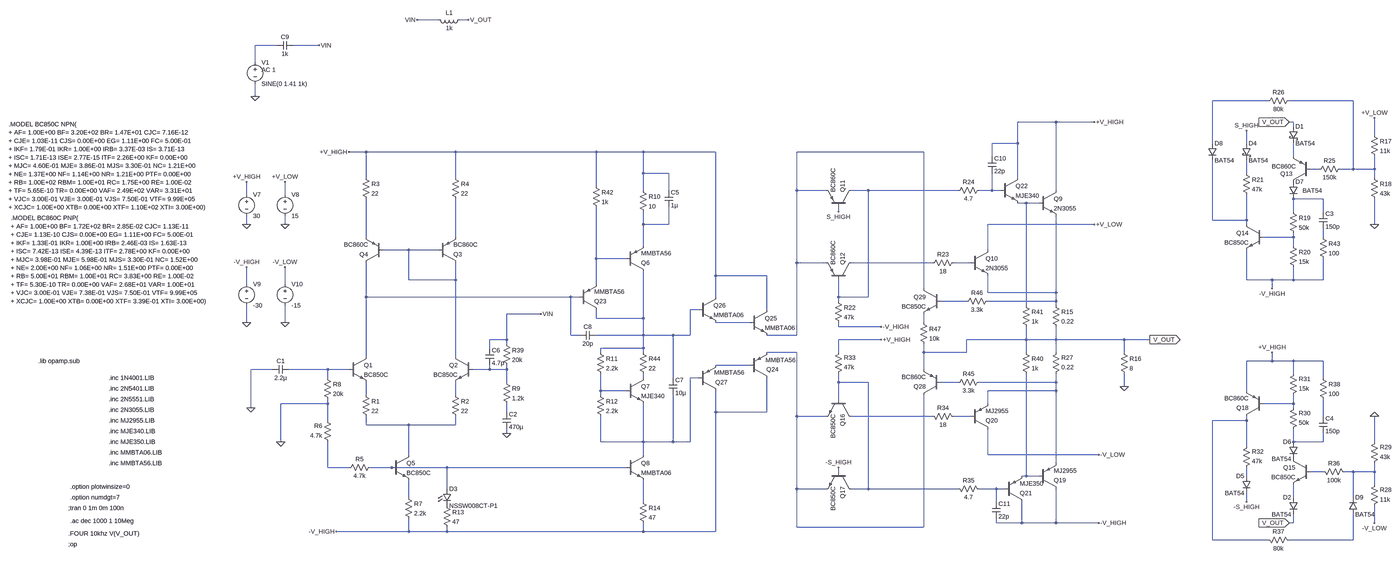
[diagram p0: schematic TPdisenio compensacion.asc, whole sheet]
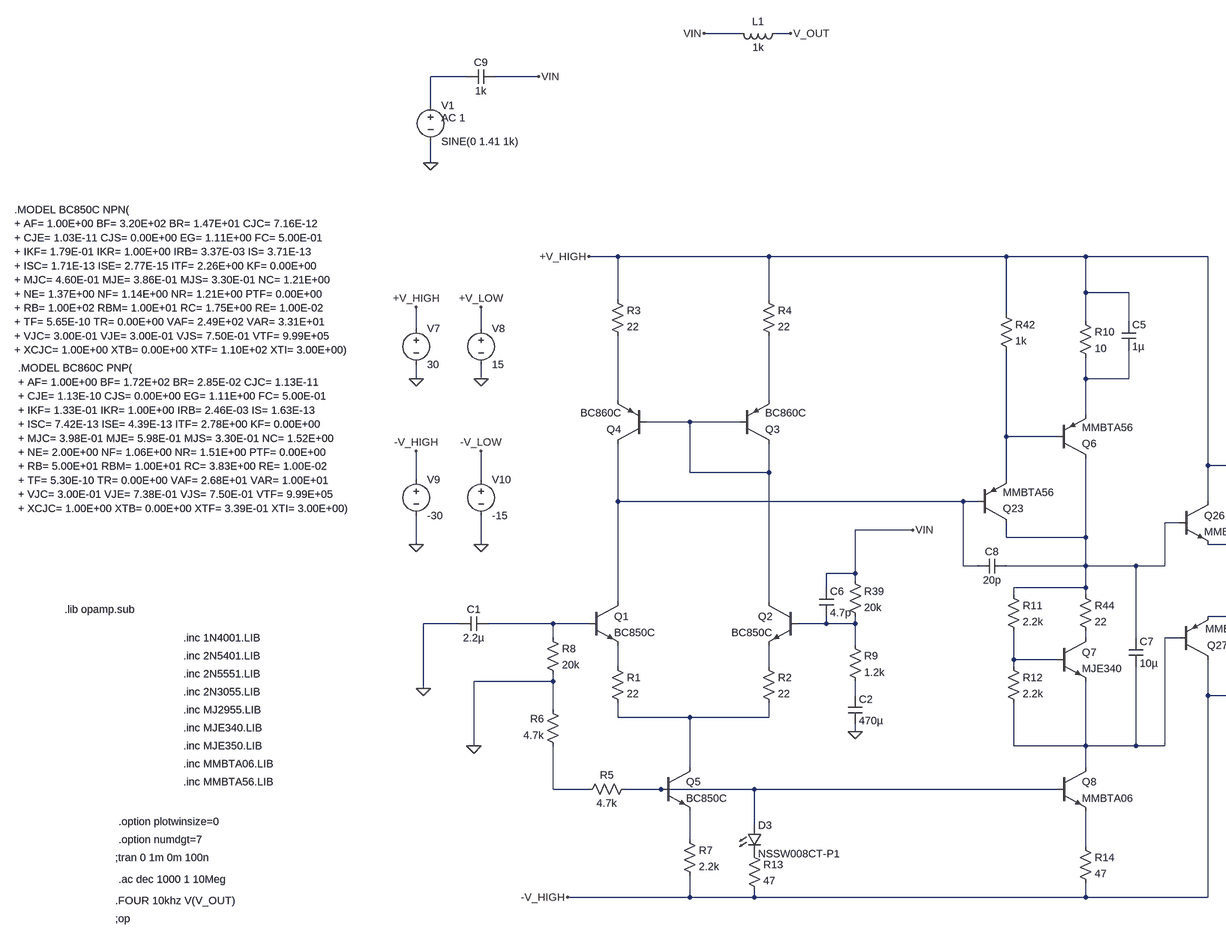
[diagram p1: schematic TPdisenio compensacion.asc, part, row 1 of 1, column 1 of 2]
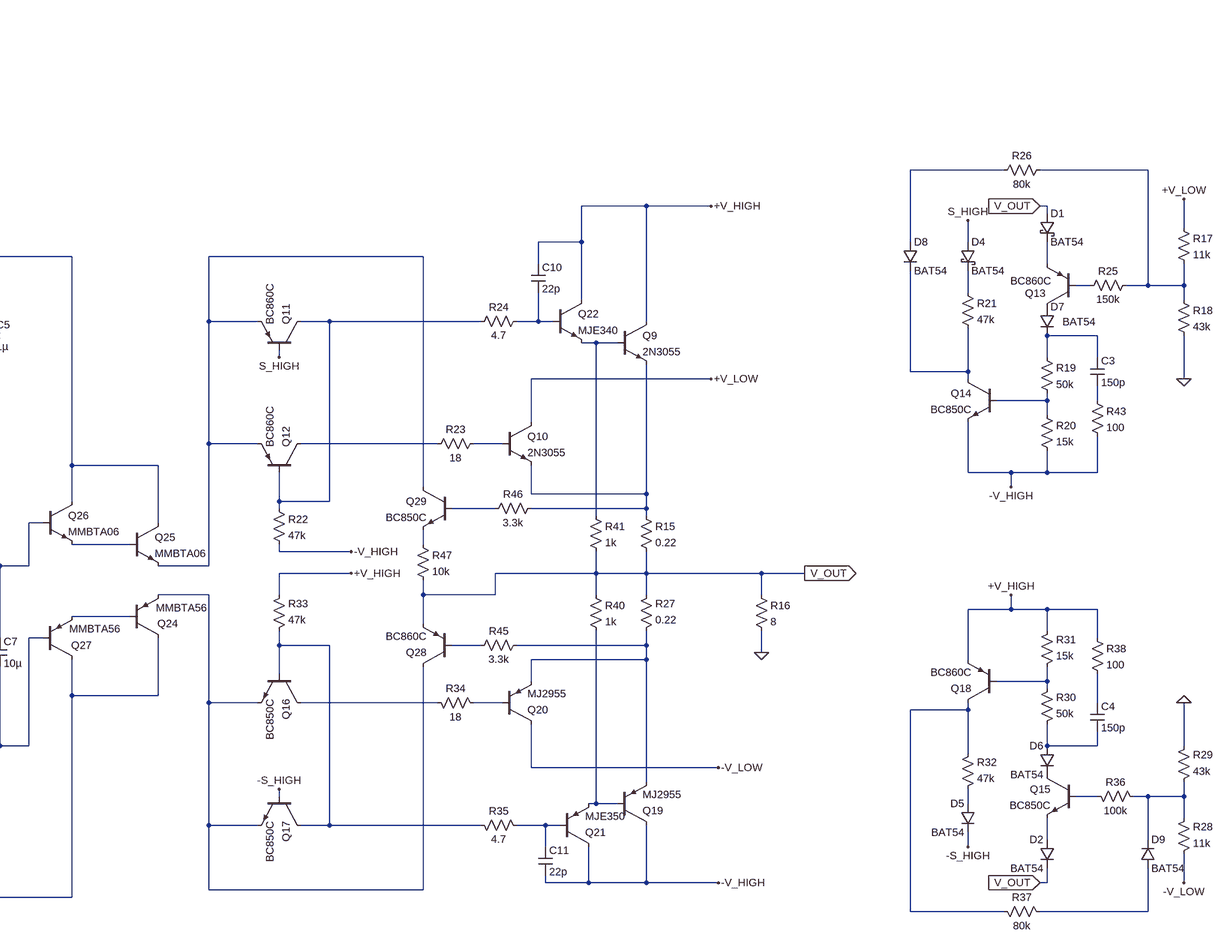
[diagram p2: schematic TPdisenio compensacion.asc, part, row 1 of 1, column 2 of 2]
TPdisenio compensacion.asc, the LTspice schematic file:
Version 4
SHEET 1 4516 2796
WIRE 544 -1120 464 -1120
WIRE 656 -1120 624 -1120
WIRE -64 -1024 -144 -1024
WIRE 96 -1024 0 -1024
WIRE -144 -960 -144 -1024
WIRE -144 -832 -144 -880
WIRE 3712 -816 3504 -816
WIRE 4032 -816 3792 -816
WIRE 2864 -736 2720 -736
WIRE 3008 -736 2864 -736
WIRE 3808 -736 3792 -736
WIRE 3808 -720 3808 -736
WIRE 4112 -688 4112 -752
WIRE 2720 -656 2720 -736
WIRE 2720 -656 2624 -656
WIRE 3504 -656 3504 -816
WIRE 3632 -656 3632 -704
WIRE 272 -624 208 -624
WIRE 608 -624 272 -624
WIRE 1136 -624 608 -624
WIRE 1312 -624 1136 -624
WIRE 1584 -624 1312 -624
WIRE 2368 -624 1888 -624
WIRE 2624 -608 2624 -656
WIRE 3808 -608 3808 -656
WIRE 3904 -560 3872 -560
WIRE 4032 -560 4032 -816
WIRE 4032 -560 3984 -560
WIRE 4112 -560 4112 -608
WIRE 4112 -560 4032 -560
WIRE 1312 -544 1312 -624
WIRE 1408 -544 1312 -544
WIRE 3632 -544 3632 -592
WIRE 272 -528 272 -624
WIRE 608 -528 608 -624
WIRE 2720 -528 2720 -656
WIRE 4112 -528 4112 -560
WIRE 1136 -496 1136 -624
WIRE 1312 -480 1312 -544
WIRE 1408 -480 1408 -544
WIRE 1888 -480 1888 -624
WIRE 2000 -480 1888 -480
WIRE 2160 -480 2096 -480
WIRE 2496 -480 2160 -480
WIRE 2624 -480 2624 -544
WIRE 2624 -480 2576 -480
WIRE 2656 -480 2624 -480
WIRE 2864 -480 2864 -736
WIRE -176 -464 -176 -512
WIRE -32 -464 -32 -512
WIRE 3920 -448 3808 -448
WIRE 2752 -432 2720 -432
WIRE 2800 -432 2752 -432
WIRE 2048 -400 2048 -416
WIRE 3808 -400 3808 -448
WIRE 3920 -400 3920 -448
WIRE 3504 -368 3504 -592
WIRE 3632 -368 3632 -464
WIRE 3632 -368 3504 -368
WIRE -176 -352 -176 -384
WIRE -32 -352 -32 -384
WIRE 1312 -352 1312 -400
WIRE 1408 -352 1408 -416
WIRE 1408 -352 1312 -352
WIRE 3008 -352 2608 -352
WIRE 3632 -352 3632 -368
WIRE 4112 -352 4112 -448
WIRE 272 -304 272 -448
WIRE 608 -304 608 -448
WIRE 3808 -304 3808 -320
WIRE 3808 -304 3696 -304
WIRE 3920 -304 3920 -336
WIRE 1312 -272 1312 -352
WIRE 3808 -272 3808 -304
WIRE 432 -256 336 -256
WIRE 544 -256 432 -256
WIRE 2608 -256 2608 -352
WIRE 1136 -224 1136 -416
WIRE 1248 -224 1136 -224
WIRE 1888 -208 1888 -480
WIRE 2000 -208 1888 -208
WIRE 2400 -208 2096 -208
WIRE 2544 -208 2480 -208
WIRE 1584 -160 1584 -624
WIRE 1776 -160 1584 -160
WIRE 432 -144 432 -256
WIRE 608 -144 608 -208
WIRE 608 -144 432 -144
WIRE 3632 -144 3632 -256
WIRE 3728 -144 3632 -144
WIRE 3808 -144 3808 -192
WIRE 3808 -144 3728 -144
WIRE 3920 -144 3920 -224
WIRE 3920 -144 3808 -144
WIRE -176 -128 -176 -192
WIRE -32 -128 -32 -192
WIRE 1136 -128 1136 -224
WIRE 2368 -112 2368 -624
WIRE 3728 -112 3728 -144
WIRE 2608 -96 2608 -160
WIRE 2864 -96 2864 -384
WIRE 2864 -96 2608 -96
WIRE 272 -80 272 -208
WIRE 1040 -80 272 -80
WIRE 1072 -80 1040 -80
WIRE 1584 -80 1584 -160
WIRE 2048 -80 2048 -144
WIRE 2160 -80 2160 -480
WIRE 2160 -80 2048 -80
WIRE 2048 -64 2048 -80
WIRE 2528 -64 2432 -64
WIRE 2864 -64 2864 -96
WIRE 2864 -64 2608 -64
WIRE 2752 -48 2752 -432
WIRE 2864 -48 2864 -64
WIRE 1520 -32 1488 -32
WIRE 1776 -32 1776 -160
WIRE 928 -16 800 -16
WIRE 1136 0 1136 -32
WIRE 1312 0 1312 -176
WIRE 1312 0 1136 0
WIRE -176 16 -176 -48
WIRE -32 16 -32 -48
WIRE 1712 16 1584 16
WIRE 2368 16 2368 -16
WIRE 2048 32 2048 16
WIRE 2208 32 2048 32
WIRE 1040 64 1040 -80
WIRE 1072 64 1040 64
WIRE 1312 64 1312 0
WIRE 1312 64 1136 64
WIRE 1424 64 1312 64
WIRE 1488 64 1488 -32
WIRE 1488 64 1424 64
WIRE 1888 64 1888 -208
WIRE 1888 64 1776 64
WIRE 800 80 800 -16
WIRE 800 80 736 80
WIRE 2208 80 2048 80
WIRE 2752 80 2752 32
WIRE 2752 80 2528 80
WIRE 2864 80 2864 32
WIRE 2864 80 2752 80
WIRE 3120 80 2864 80
WIRE 3216 80 3120 80
WIRE 800 96 800 80
WIRE 736 112 736 80
WIRE 1312 112 1312 64
WIRE 1312 112 1152 112
WIRE 1152 128 1152 112
WIRE 1312 128 1312 112
WIRE 1888 128 1776 128
WIRE 2048 128 2048 80
WIRE 2368 128 2368 96
WIRE 2528 128 2528 80
WIRE 2528 128 2368 128
WIRE 2752 128 2752 80
WIRE 2864 128 2864 80
WIRE 3120 128 3120 80
WIRE 272 144 272 -80
WIRE 608 144 608 -144
WIRE 3728 160 3728 128
WIRE 3728 160 3632 160
WIRE 3808 160 3728 160
WIRE 3920 160 3808 160
WIRE 1712 176 1584 176
WIRE -80 192 -160 192
WIRE 128 192 -16 192
WIRE 208 192 128 192
WIRE 736 192 736 176
WIRE 736 192 672 192
WIRE 800 192 800 176
WIRE 800 192 736 192
WIRE 2368 192 2368 128
WIRE 3808 208 3808 160
WIRE 128 224 128 192
WIRE 1312 224 1312 208
WIRE 1424 224 1424 64
WIRE 1520 224 1488 224
WIRE 3920 224 3920 160
WIRE 800 240 800 192
WIRE 2048 240 2048 208
WIRE 2160 240 2048 240
WIRE 2496 240 2432 240
WIRE 2864 240 2864 208
WIRE 2864 240 2576 240
WIRE 3120 256 3120 208
WIRE 1152 272 1152 208
WIRE 1248 272 1152 272
WIRE 2864 272 2864 240
WIRE 2864 272 2608 272
WIRE 3632 272 3632 160
WIRE 272 288 272 240
WIRE 608 288 608 240
WIRE 1152 288 1152 272
WIRE 2048 304 2048 240
WIRE 128 320 128 304
WIRE 128 320 -48 320
WIRE 2608 320 2608 272
WIRE 3808 320 3808 288
WIRE 3808 320 3696 320
WIRE -160 336 -160 192
WIRE 3808 336 3808 320
WIRE 800 352 800 320
WIRE 1584 352 1584 272
WIRE 1776 352 1776 224
WIRE 1776 352 1584 352
WIRE 1888 368 1888 128
WIRE 2000 368 1888 368
WIRE 2400 368 2096 368
WIRE 2544 368 2480 368
WIRE 3920 368 3920 304
WIRE 128 384 128 320
WIRE 3632 384 3632 368
WIRE 3632 384 3504 384
WIRE 272 400 272 368
WIRE 432 400 272 400
WIRE 608 400 608 368
WIRE 608 400 432 400
WIRE 800 432 800 416
WIRE -48 464 -48 320
WIRE 1152 464 1152 368
WIRE 1312 464 1312 320
WIRE 1312 464 1152 464
WIRE 1424 464 1424 288
WIRE 1424 464 1312 464
WIRE 1488 464 1488 224
WIRE 1488 464 1424 464
WIRE 3808 464 3808 416
WIRE 3920 464 3920 432
WIRE 3920 464 3808 464
WIRE 4112 464 4112 368
WIRE 3632 480 3632 384
WIRE 432 512 432 400
WIRE 1312 512 1312 464
WIRE 2608 512 2608 416
WIRE 3024 512 2608 512
WIRE 2864 544 2864 272
WIRE 128 560 128 464
WIRE 208 560 128 560
WIRE 368 560 288 560
WIRE 576 560 368 560
WIRE 1248 560 576 560
WIRE 2048 576 2048 560
WIRE 3920 576 3872 576
WIRE 4032 576 4000 576
WIRE 4112 576 4112 544
WIRE 4112 576 4032 576
WIRE 2752 592 2752 208
WIRE 2752 592 2736 592
WIRE 2800 592 2752 592
WIRE 3632 592 3632 560
WIRE 4112 624 4112 576
WIRE 576 640 576 560
WIRE 1888 640 1888 368
WIRE 2000 640 1888 640
WIRE 2160 640 2160 240
WIRE 2160 640 2096 640
WIRE 2496 640 2160 640
WIRE 2640 640 2576 640
WIRE 2672 640 2640 640
WIRE 432 672 432 608
WIRE 3808 672 3808 624
WIRE 4032 672 4032 576
WIRE 1312 688 1312 608
WIRE 2640 688 2640 640
WIRE 3632 688 3632 656
WIRE 2640 768 2640 752
WIRE 2736 768 2736 688
WIRE 2736 768 2640 768
WIRE 2864 768 2864 640
WIRE 2864 768 2736 768
WIRE 3024 768 2864 768
WIRE 3808 768 3808 736
WIRE 3808 768 3792 768
WIRE 4112 768 4112 704
WIRE 1888 784 1888 640
WIRE 2368 784 2368 288
WIRE 2368 784 1888 784
WIRE 432 800 432 752
WIRE 432 800 160 800
WIRE 576 800 576 784
WIRE 576 800 432 800
WIRE 1312 800 1312 768
WIRE 1312 800 576 800
WIRE 1584 800 1584 352
WIRE 1584 800 1312 800
WIRE 3504 832 3504 384
WIRE 3712 832 3504 832
WIRE 4032 832 4032 736
WIRE 4032 832 3792 832
FLAG -48 464 0
FLAG 800 432 0
FLAG -160 336 0
FLAG 3008 -736 +V_HIGH
FLAG 3008 -352 +V_LOW
FLAG 3120 256 0
FLAG 4112 -352 0
FLAG 4112 -752 +V_LOW
FLAG 3216 80 V_OUT
IOPIN 3216 80 Out
FLAG 3792 -736 V_OUT
IOPIN 3792 -736 In
FLAG 3728 -112 -V_HIGH
FLAG 2048 -400 S_HIGH
FLAG 3632 -704 S_HIGH
FLAG 2208 32 -V_HIGH
FLAG 3024 768 -V_HIGH
FLAG 3024 512 -V_LOW
FLAG 4112 368 0
FLAG 4112 768 -V_LOW
FLAG 3792 768 V_OUT
IOPIN 3792 768 In
FLAG 3728 128 +V_HIGH
FLAG 2048 560 -S_HIGH
FLAG 3632 688 -S_HIGH
FLAG 2208 80 +V_HIGH
FLAG -176 -352 0
FLAG -32 -352 0
FLAG -176 -512 +V_HIGH
FLAG -32 -512 +V_LOW
FLAG -176 16 0
FLAG -32 16 0
FLAG -176 -192 -V_HIGH
FLAG -32 -192 -V_LOW
FLAG 208 -624 +V_HIGH
FLAG 160 800 -V_HIGH
FLAG 464 -1120 VIN
FLAG 656 -1120 V_OUT
FLAG 96 -1024 VIN
FLAG -144 -832 0
FLAG 928 -16 VIN
SYMBOL npn 208 144 R0
SYMATTR InstName Q1
SYMATTR Value BC850C
SYMBOL npn 672 144 M0
SYMATTR InstName Q2
SYMATTR Value BC850C
SYMBOL pnp 544 -208 M180
SYMATTR InstName Q3
SYMATTR Value BC860C
SYMBOL pnp 336 -208 R180
SYMATTR InstName Q4
SYMATTR Value BC860C
SYMBOL res 256 272 R0
SYMATTR InstName R1
SYMATTR Value 22
SYMBOL res 592 272 R0
SYMATTR InstName R2
SYMATTR Value 22
SYMBOL res 256 -544 R0
SYMATTR InstName R3
SYMATTR Value 22
SYMBOL res 592 -544 R0
SYMATTR InstName R4
SYMATTR Value 22
SYMBOL npn 368 512 R0
SYMATTR InstName Q5
SYMATTR Value BC850C
SYMBOL res 304 544 R90
WINDOW 0 0 56 VBottom 2
WINDOW 3 32 56 VTop 2
SYMATTR InstName R5
SYMATTR Value 4.7k
SYMBOL res 144 480 R180
WINDOW 0 36 76 Left 2
WINDOW 3 36 40 Left 2
SYMATTR InstName R6
SYMATTR Value 4.7k
SYMBOL res 416 656 R0
SYMATTR InstName R7
SYMATTR Value 2.2k
SYMBOL res 112 208 R0
SYMATTR InstName R8
SYMATTR Value 20k
SYMBOL res 784 224 R0
SYMATTR InstName R9
SYMATTR Value 1.2k
SYMBOL cap -16 176 R90
WINDOW 0 0 32 VBottom 2
WINDOW 3 32 32 VTop 2
SYMATTR InstName C1
SYMATTR Value 2.2µ
SYMBOL pnp 1248 -176 M180
SYMATTR InstName Q6
SYMATTR Value MMBTA56
SYMBOL res 1296 -496 R0
SYMATTR InstName R10
SYMATTR Value 10
SYMBOL npn 1248 224 R0
SYMATTR InstName Q7
SYMATTR Value MJE340
SYMBOL res 1136 112 R0
SYMATTR InstName R11
SYMATTR Value 2.2k
SYMBOL res 1136 272 R0
SYMATTR InstName R12
SYMATTR Value 2.2k
SYMBOL npn 1248 512 R0
SYMATTR InstName Q8
SYMATTR Value MMBTA06
SYMBOL res 1296 672 R0
SYMATTR InstName R14
SYMATTR Value 47
SYMBOL cap 784 352 R0
SYMATTR InstName C2
SYMATTR Value 470µ
SYMBOL npn 2800 -480 R0
SYMATTR InstName Q9
SYMATTR Value 2N3055
SYMBOL npn 2544 -256 R0
SYMATTR InstName Q10
SYMATTR Value 2N3055
SYMBOL res 2848 -64 R0
SYMATTR InstName R15
SYMATTR Value 0.22
SYMBOL pnp 2096 -416 M270
SYMATTR InstName Q11
SYMATTR Value BC860C
SYMBOL pnp 2096 -144 M270
SYMATTR InstName Q12
SYMATTR Value BC860C
SYMBOL res 3104 112 R0
SYMATTR InstName R16
SYMATTR Value 8
SYMBOL res 4096 -704 R0
SYMATTR InstName R17
SYMATTR Value 11k
SYMBOL res 4096 -544 R0
SYMATTR InstName R18
SYMATTR Value 43k
SYMBOL pnp 3872 -512 R180
WINDOW 0 67 30 Left 2
WINDOW 3 55 58 Left 2
SYMATTR InstName Q13
SYMATTR Value BC860C
SYMBOL res 3792 -416 R0
SYMATTR InstName R19
SYMATTR Value 50k
SYMBOL res 3792 -288 R0
SYMATTR InstName R20
SYMATTR Value 15k
SYMBOL npn 3696 -352 M0
SYMATTR InstName Q14
SYMATTR Value BC850C
SYMBOL res 3616 -560 R0
SYMATTR InstName R21
SYMATTR Value 47k
SYMBOL res 2032 -80 R0
SYMATTR InstName R22
SYMATTR Value 47k
SYMBOL cap 3904 -400 R0
SYMATTR InstName C3
SYMATTR Value 150p
SYMBOL schottky 3792 -720 R0
SYMATTR InstName D1
SYMATTR Value BAT54
SYMATTR Description Diode
SYMATTR Type diode
SYMBOL res 2496 -224 R90
WINDOW 0 0 56 VBottom 2
WINDOW 3 32 56 VTop 2
SYMATTR InstName R23
SYMATTR Value 18
SYMBOL res 2592 -496 R90
WINDOW 0 0 56 VBottom 2
WINDOW 3 32 56 VTop 2
SYMATTR InstName R24
SYMATTR Value 4.7
SYMBOL res 4000 -576 R90
WINDOW 0 0 56 VBottom 2
WINDOW 3 32 56 VTop 2
SYMATTR InstName R25
SYMATTR Value 150k
SYMBOL res 3808 -832 R90
WINDOW 0 0 56 VBottom 2
WINDOW 3 32 56 VTop 2
SYMATTR InstName R26
SYMATTR Value 80k
SYMBOL res 2848 224 M180
WINDOW 0 36 76 Left 2
WINDOW 3 36 40 Left 2
SYMATTR InstName R27
SYMATTR Value 0.22
SYMBOL res 4096 720 M180
WINDOW 0 36 76 Left 2
WINDOW 3 36 40 Left 2
SYMATTR InstName R28
SYMATTR Value 11k
SYMBOL res 4096 560 M180
WINDOW 0 36 76 Left 2
WINDOW 3 36 40 Left 2
SYMATTR InstName R29
SYMATTR Value 43k
SYMBOL res 3792 432 M180
WINDOW 0 36 76 Left 2
WINDOW 3 36 40 Left 2
SYMATTR InstName R30
SYMATTR Value 50k
SYMBOL res 3792 304 M180
WINDOW 0 36 76 Left 2
WINDOW 3 36 40 Left 2
SYMATTR InstName R31
SYMATTR Value 15k
SYMBOL res 3616 576 M180
WINDOW 0 36 76 Left 2
WINDOW 3 36 40 Left 2
SYMATTR InstName R32
SYMATTR Value 47k
SYMBOL res 2032 224 M180
WINDOW 0 36 76 Left 2
WINDOW 3 36 40 Left 2
SYMATTR InstName R33
SYMATTR Value 47k
SYMBOL cap 3904 432 M180
WINDOW 0 24 56 Left 2
WINDOW 3 24 8 Left 2
SYMATTR InstName C4
SYMATTR Value 150p
SYMBOL diode 3824 672 M0
SYMATTR InstName D2
SYMATTR Value BAT54
SYMBOL res 2496 384 M270
WINDOW 0 32 56 VTop 2
WINDOW 3 0 56 VBottom 2
SYMATTR InstName R34
SYMATTR Value 18
SYMBOL res 2592 656 M270
WINDOW 0 32 56 VTop 2
WINDOW 3 0 56 VBottom 2
SYMATTR InstName R35
SYMATTR Value 4.7
SYMBOL res 4016 592 M270
WINDOW 0 32 56 VTop 2
WINDOW 3 0 56 VBottom 2
SYMATTR InstName R36
SYMATTR Value 100k
SYMBOL res 3808 848 M270
WINDOW 0 32 56 VTop 2
WINDOW 3 0 56 VBottom 2
SYMATTR InstName R37
SYMATTR Value 80k
SYMBOL npn 3872 528 M0
SYMATTR InstName Q15
SYMATTR Value BC850C
SYMBOL npn 2096 304 R90
SYMATTR InstName Q16
SYMATTR Value BC850C
SYMBOL npn 2096 576 R90
SYMATTR InstName Q17
SYMATTR Value BC850C
SYMBOL pnp 3696 368 R180
SYMATTR InstName Q18
SYMATTR Value BC860C
SYMBOL pnp 2800 640 M180
SYMATTR InstName Q19
SYMATTR Value MJ2955
SYMBOL pnp 2544 416 M180
SYMATTR InstName Q20
SYMATTR Value MJ2955
SYMBOL voltage -176 -480 R0
WINDOW 123 0 0 Left 0
WINDOW 39 0 0 Left 0
SYMATTR InstName V7
SYMATTR Value 30
SYMBOL voltage -32 -480 R0
WINDOW 123 0 0 Left 0
WINDOW 39 0 0 Left 0
SYMATTR InstName V8
SYMATTR Value 15
SYMBOL voltage -176 -144 R0
WINDOW 123 0 0 Left 0
WINDOW 39 0 0 Left 0
SYMATTR InstName V9
SYMATTR Value -30
SYMBOL voltage -32 -144 R0
WINDOW 123 0 0 Left 0
WINDOW 39 0 0 Left 0
SYMATTR InstName V10
SYMATTR Value -15
SYMBOL res 784 80 R0
SYMATTR InstName R39
SYMATTR Value 20k
SYMBOL LED 560 640 R0
SYMATTR InstName D3
SYMATTR Value NSSW008CT-P1
SYMBOL cap 1392 -480 R0
SYMATTR InstName C5
SYMATTR Value 1µ
SYMBOL pnp 2672 688 M180
SYMATTR InstName Q21
SYMATTR Value MJE350
SYMBOL res 2736 112 R0
SYMATTR InstName R40
SYMATTR Value 1k
SYMBOL npn 2656 -528 R0
SYMATTR InstName Q22
SYMATTR Value MJE340
SYMBOL res 2736 -64 R0
SYMATTR InstName R41
SYMATTR Value 1k
SYMBOL res 560 688 R0
SYMATTR InstName R13
SYMATTR Value 47
SYMBOL cap 720 112 R0
SYMATTR InstName C6
SYMATTR Value 4.7p
SYMBOL pnp 1072 -32 M180
SYMATTR InstName Q23
SYMATTR Value MMBTA56
SYMBOL res 1120 -512 R0
SYMATTR InstName R42
SYMATTR Value 1k
SYMBOL cap 1136 48 R90
WINDOW 0 0 32 VBottom 2
WINDOW 3 32 32 VTop 2
SYMATTR InstName C8
SYMATTR Value 20p
SYMBOL cap 1408 224 R0
SYMATTR InstName C7
SYMATTR Value 10µ
SYMBOL schottky 3616 -656 R0
SYMATTR InstName D4
SYMATTR Value BAT54
SYMATTR Description Diode
SYMATTR Type diode
SYMBOL diode 3648 592 M0
SYMATTR InstName D5
SYMATTR Value BAT54
SYMBOL diode 3824 464 M0
SYMATTR InstName D6
SYMATTR Value BAT54
SYMBOL diode 3792 -512 R0
WINDOW 3 50 33 Left 2
SYMATTR Value BAT54
SYMATTR InstName D7
SYMBOL diode 3488 -656 R0
SYMATTR InstName D8
SYMATTR Value BAT54
SYMBOL diode 4016 736 M180
WINDOW 0 24 64 Left 2
WINDOW 3 24 0 Left 2
SYMATTR InstName D9
SYMATTR Value BAT54
SYMBOL pnp 1712 224 M180
WINDOW 0 62 32 Left 2
WINDOW 3 59 67 Left 2
SYMATTR InstName Q24
SYMATTR Value MMBTA56
SYMBOL npn 1712 -32 R0
SYMATTR InstName Q25
SYMATTR Value MMBTA06
SYMBOL npn 1520 -80 R0
SYMATTR InstName Q26
SYMATTR Value MMBTA06
SYMBOL pnp 1520 272 M180
WINDOW 0 62 32 Left 2
WINDOW 3 58 68 Left 2
SYMATTR InstName Q27
SYMATTR Value MMBTA56
SYMBOL res 1296 112 R0
SYMATTR InstName R44
SYMATTR Value 22
SYMBOL res 2592 224 R90
WINDOW 0 0 56 VBottom 2
WINDOW 3 32 56 VTop 2
SYMATTR InstName R45
SYMATTR Value 3.3k
SYMBOL res 2624 -80 R90
WINDOW 0 0 56 VBottom 2
WINDOW 3 32 56 VTop 2
SYMATTR InstName R46
SYMATTR Value 3.3k
SYMBOL pnp 2432 288 R180
SYMATTR InstName Q28
SYMATTR Value BC860C
SYMBOL npn 2432 -112 M0
SYMATTR InstName Q29
SYMATTR Value BC850C
SYMBOL res 2352 0 R0
SYMATTR InstName R47
SYMATTR Value 10k
SYMBOL res 3904 208 R0
SYMATTR InstName R38
SYMATTR Value 100
SYMBOL res 3904 -320 R0
SYMATTR InstName R43
SYMATTR Value 100
SYMBOL ind 640 -1136 R90
WINDOW 0 5 56 VBottom 2
WINDOW 3 32 56 VTop 2
SYMATTR InstName L1
SYMATTR Value 1k
SYMBOL voltage -144 -976 R0
WINDOW 123 24 44 Left 2
WINDOW 39 0 0 Left 0
SYMATTR Value2 AC 1
SYMATTR InstName V1
SYMATTR Value SINE(0 1.41 1k)
SYMBOL cap 0 -1040 R90
WINDOW 0 0 32 VBottom 2
WINDOW 3 32 32 VTop 2
SYMATTR InstName C9
SYMATTR Value 1k
SYMBOL cap 2608 -608 R0
SYMATTR InstName C10
SYMATTR Value 22p
SYMBOL cap 2624 688 R0
SYMATTR InstName C11
SYMATTR Value 22p
TEXT -992 712 Left 2 !;tran 0 1m 0m 100n
TEXT -992 808 Left 2 !.FOUR 10khz V(V_OUT)
TEXT -840 384 Left 2 !.inc MJ2955.LIB
TEXT -840 344 Left 2 !.inc 2N3055.LIB
TEXT -840 304 Left 2 !.inc 2N5551.LIB
TEXT -840 264 Left 2 !.inc 2N5401.LIB
TEXT -840 224 Left 2 !.inc 1N4001.LIB
TEXT -1216 -728 Left 2 !.MODEL BC850C NPN(\n+ AF= 1.00E+00 BF= 3.20E+02 BR= 1.47E+01 CJC= 7.16E-12\n+ CJE= 1.03E-11 CJS= 0.00E+00 EG= 1.11E+00 FC= 5.00E-01\n+ IKF= 1.79E-01 IKR= 1.00E+00 IRB= 3.37E-03 IS= 3.71E-13\n+ ISC= 1.71E-13 ISE= 2.77E-15 ITF= 2.26E+00 KF= 0.00E+00\n+ MJC= 4.60E-01 MJE= 3.86E-01 MJS= 3.30E-01 NC= 1.21E+00\n+ NE= 1.37E+00 NF= 1.14E+00 NR= 1.21E+00 PTF= 0.00E+00\n+ RB= 1.00E+02 RBM= 1.00E+01 RC= 1.75E+00 RE= 1.00E-02\n+ TF= 5.65E-10 TR= 0.00E+00 VAF= 2.49E+02 VAR= 3.31E+01\n+ VJC= 3.00E-01 VJE= 3.00E-01 VJS= 7.50E-01 VTF= 9.99E+05\n+ XCJC= 1.00E+00 XTB= 0.00E+00 XTF= 1.10E+02 XTI= 3.00E+00)
TEXT -1208 -376 Left 2 !.MODEL BC860C PNP(\n+ AF= 1.00E+00 BF= 1.72E+02 BR= 2.85E-02 CJC= 1.13E-11\n+ CJE= 1.13E-10 CJS= 0.00E+00 EG= 1.11E+00 FC= 5.00E-01\n+ IKF= 1.33E-01 IKR= 1.00E+00 IRB= 2.46E-03 IS= 1.63E-13\n+ ISC= 7.42E-13 ISE= 4.39E-13 ITF= 2.78E+00 KF= 0.00E+00\n+ MJC= 3.98E-01 MJE= 5.98E-01 MJS= 3.30E-01 NC= 1.52E+00\n+ NE= 2.00E+00 NF= 1.06E+00 NR= 1.51E+00 PTF= 0.00E+00\n+ RB= 5.00E+01 RBM= 1.00E+01 RC= 3.83E+00 RE= 1.00E-02\n+ TF= 5.30E-10 TR= 0.00E+00 VAF= 2.68E+01 VAR= 1.00E+01\n+ VJC= 3.00E-01 VJE= 7.38E-01 VJS= 7.50E-01 VTF= 9.99E+05\n+ XCJC= 1.00E+00 XTB= 0.00E+00 XTF= 3.39E-01 XTI= 3.00E+00)
TEXT -1104 160 Left 2 !.lib opamp.sub
TEXT -984 760 Left 2 !.ac dec 1000 1 10Meg
TEXT -992 848 Left 2 !;op
TEXT -984 672 Left 2 !.option numdgt=7
TEXT -840 424 Left 2 !.inc MJE340.LIB
TEXT -840 464 Left 2 !.inc MJE350.LIB
TEXT -840 504 Left 2 !.inc MMBTA06.LIB
TEXT -840 544 Left 2 !.inc MMBTA56.LIB
TEXT -984 632 Left 2 !.option plotwinsize=0

The netlist it stands for:
* TPdisenio compensacion.asc
Q1 N023 N030 N038 0 BC850C
Q2 N018 N031 N039 0 BC850C
Q3 N018 N018 N015 0 BC860C
Q4 N023 N018 N014 0 BC860C
R1 N038 N046 22
R2 N039 N046 22
R3 +V_HIGH N014 22
R4 +V_HIGH N015 22
Q5 N046 N049 N055 0 BC850C
R5 N049 N048 4.7k
R6 N048 0 4.7k
R7 N055 -V_HIGH 2.2k
R8 N030 0 20k
R9 N031 N041 1.2k
C1 N030 0 2.2µ
Q6 N025 N019 N013 0 MMBTA56
R10 +V_HIGH N013 10
Q7 N032 N037 N033 0 MJE340
R11 N025 N037 2.2k
R12 N037 N033 2.2k
Q8 N033 N049 N057 0 MMBTA06
R14 N057 -V_HIGH 47
C2 N041 0 470µ
Q9 +V_HIGH N011 N022 0 2N3055
Q10 +V_LOW N021 N022 0 2N3055
R15 N022 V_OUT 0.22
Q11 N008 S_HIGH N004 0 BC860C
Q12 N020 N008 N004 0 BC860C
R16 V_OUT 0 8
R17 +V_LOW N003 11k
R18 N003 0 43k
Q13 P001 N006 N005 0 BC860C
R19 N010 N016 50k
R20 N016 -V_HIGH 15k
Q14 N012 N016 -V_HIGH 0 BC850C
R21 N007 N012 47k
R22 N008 -V_HIGH 47k
C3 N010 N017 150p
D1 V_OUT N005 BAT54
R23 N021 N020 18
R24 N009 N008 4.7
R25 N003 N006 150k
R26 N003 N002 80k
R27 N036 V_OUT 0.22
R28 -V_LOW N051 11k
R29 N051 0 43k
R30 N047 N040 50k
R31 N040 +V_HIGH 15k
R32 N053 N045 47k
R33 N034 +V_HIGH 47k
C4 N047 N044 150p
D2 N056 V_OUT BAT54
R34 N043 N042 18
R35 N054 N034 4.7
R36 N051 N050 100k
R37 N058 N045 80k
Q15 P002 N050 N056 0 BC850C
Q16 N042 N034 N028 0 BC850C
Q17 N034 -S_HIGH N028 0 BC850C
Q18 N045 N040 +V_HIGH 0 BC860C
Q19 -V_HIGH N052 N036 0 MJ2955
Q20 -V_LOW N043 N036 0 MJ2955
V7 +V_HIGH 0 30
V8 +V_LOW 0 15
V9 -V_HIGH 0 -30
V10 -V_LOW 0 -15
R39 VIN N031 20k
D3 N049 P003 NSSW008CT-P1
C5 +V_HIGH N013 1µ
Q21 -V_HIGH N054 N052 0 MJE350
R40 V_OUT N052 1k
Q22 +V_HIGH N009 N011 0 MJE340
R41 N011 V_OUT 1k
R13 P003 -V_HIGH 47
C6 VIN N031 4.7p
Q23 N025 N023 N019 0 MMBTA56
R42 +V_HIGH N019 1k
C8 N025 N023 20p
C7 N025 N033 10µ
D4 S_HIGH N007 BAT54
D5 N053 -S_HIGH BAT54
D6 N047 P002 BAT54
D7 P001 N010 BAT54
D8 N002 N012 BAT54
D9 N058 N051 BAT54
Q24 -V_HIGH N029 N028 0 MMBTA56
Q25 +V_HIGH N026 N004 0 MMBTA06
Q26 +V_HIGH N025 N026 0 MMBTA06
Q27 -V_HIGH N033 N029 0 MMBTA56
R44 N025 N032 22
R45 N036 N035 3.3k
R46 N022 N024 3.3k
Q28 N028 N035 V_OUT 0 BC860C
Q29 N004 N024 N027 0 BC850C
R47 N027 V_OUT 10k
R38 +V_HIGH N044 100
R43 N017 -V_HIGH 100
L1 V_OUT VIN 1k
V1 N001 0 SINE(0 1.41 1k) AC 1
C9 VIN N001 1k
C10 +V_HIGH N009 22p
C11 N054 -V_HIGH 22p
.model D D
.lib standard.dio
.model NPN NPN
.model PNP PNP
.lib standard.bjt
;tran 0 1m 0m 100n
.FOUR 10khz V(V_OUT)
.inc MJ2955.LIB
.inc 2N3055.LIB
.inc 2N5551.LIB
.inc 2N5401.LIB
.inc 1N4001.LIB
.MODEL BC850C NPN(
+ AF= 1.00E+00 BF= 3.20E+02 BR= 1.47E+01 CJC= 7.16E-12
+ CJE= 1.03E-11 CJS= 0.00E+00 EG= 1.11E+00 FC= 5.00E-01
+ IKF= 1.79E-01 IKR= 1.00E+00 IRB= 3.37E-03 IS= 3.71E-13
+ ISC= 1.71E-13 ISE= 2.77E-15 ITF= 2.26E+00 KF= 0.00E+00
+ MJC= 4.60E-01 MJE= 3.86E-01 MJS= 3.30E-01 NC= 1.21E+00
+ NE= 1.37E+00 NF= 1.14E+00 NR= 1.21E+00 PTF= 0.00E+00
+ RB= 1.00E+02 RBM= 1.00E+01 RC= 1.75E+00 RE= 1.00E-02
+ TF= 5.65E-10 TR= 0.00E+00 VAF= 2.49E+02 VAR= 3.31E+01
+ VJC= 3.00E-01 VJE= 3.00E-01 VJS= 7.50E-01 VTF= 9.99E+05
+ XCJC= 1.00E+00 XTB= 0.00E+00 XTF= 1.10E+02 XTI= 3.00E+00)
.MODEL BC860C PNP(
+ AF= 1.00E+00 BF= 1.72E+02 BR= 2.85E-02 CJC= 1.13E-11
+ CJE= 1.13E-10 CJS= 0.00E+00 EG= 1.11E+00 FC= 5.00E-01
+ IKF= 1.33E-01 IKR= 1.00E+00 IRB= 2.46E-03 IS= 1.63E-13
+ ISC= 7.42E-13 ISE= 4.39E-13 ITF= 2.78E+00 KF= 0.00E+00
+ MJC= 3.98E-01 MJE= 5.98E-01 MJS= 3.30E-01 NC= 1.52E+00
+ NE= 2.00E+00 NF= 1.06E+00 NR= 1.51E+00 PTF= 0.00E+00
+ RB= 5.00E+01 RBM= 1.00E+01 RC= 3.83E+00 RE= 1.00E-02
+ TF= 5.30E-10 TR= 0.00E+00 VAF= 2.68E+01 VAR= 1.00E+01
+ VJC= 3.00E-01 VJE= 7.38E-01 VJS= 7.50E-01 VTF= 9.99E+05
+ XCJC= 1.00E+00 XTB= 0.00E+00 XTF= 3.39E-01 XTI= 3.00E+00)
.lib opamp.sub
.ac dec 1000 1 10Meg
;op
.option numdgt=7
.inc MJE340.LIB
.inc MJE350.LIB
.inc MMBTA06.LIB
.inc MMBTA56.LIB
.option plotwinsize=0
.backanno
.end